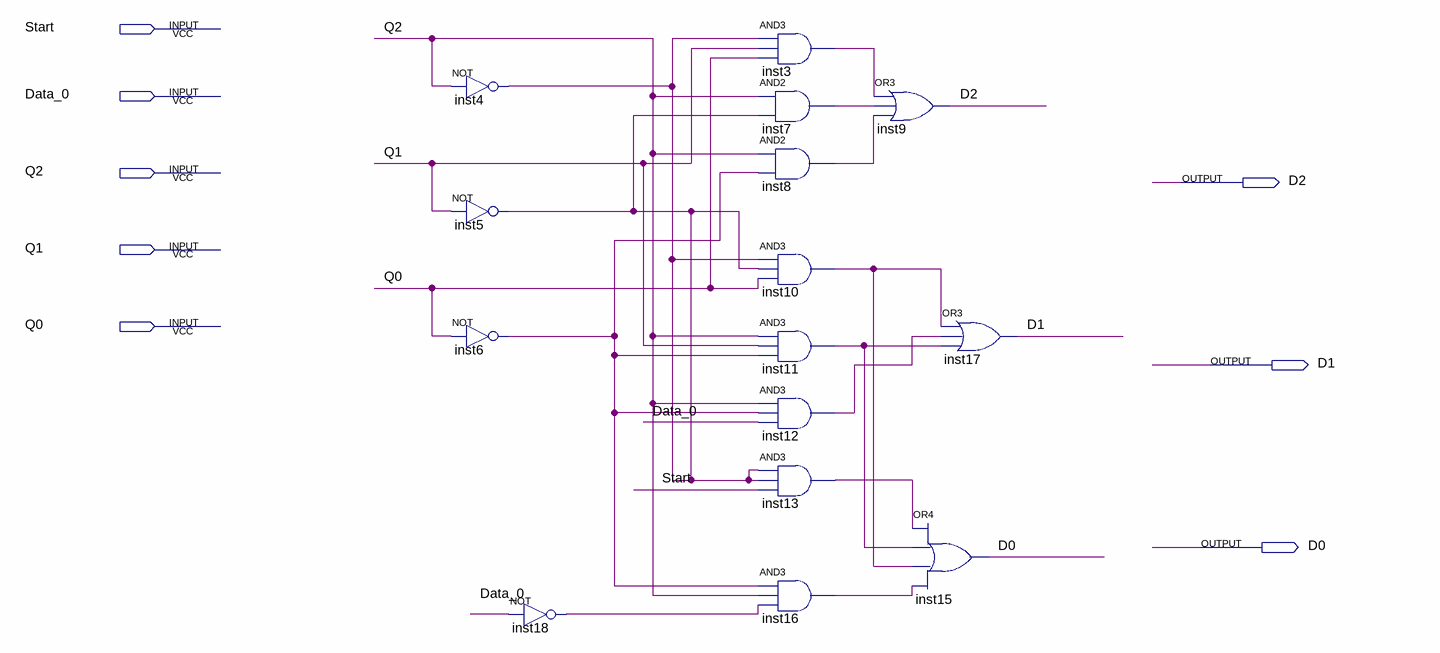
[diagram p0: schematic sheet]
// Quartus schematic Next_State.bdf as structural Verilog: 15 symbols, 8 pins
module Next_State (
  input  Start,
  input  Data_0,
  input  Q2,
  input  Q1,
  input  Q0,
  output D2,
  output D1,
  output D0
);

  wire inst3_out, inst4_out, inst6_out, inst7_out, inst8_out, inst10_out, inst11_out, inst12_out, inst13_out,
       inst16_out, inst18_out;

  not inst4 (inst4_out, Q2);
  not inst5 (inst4_out, Q1);
  not inst6 (inst6_out, Q0);
  not inst18 (inst18_out, Data_0);
  and inst3 (inst3_out, inst4_out, Q1, Q0);
  and inst7 (inst7_out, Q2, inst4_out);
  and inst8 (inst8_out, Q2, inst6_out);
  and inst10 (inst10_out, inst4_out, inst4_out, Q0);
  and inst11 (inst11_out, Q2, Q1, inst6_out);
  and inst12 (inst12_out, Q2, inst6_out, Data_0);
  and inst13 (inst13_out, inst4_out, inst4_out, Start);
  and inst16 (inst16_out, inst6_out, Q2, inst18_out);
  or inst9 (D2, inst3_out, inst7_out, inst8_out);
  or inst15 (D0, inst13_out, inst11_out, inst10_out, inst16_out);
  or inst17 (D1, inst10_out, inst12_out, inst11_out);
endmodule
